# Altium schematic sheet 28pins_Antariksh_unoR3_V1I1_Schematic.SchDoc (part 1 of 5)
size A2
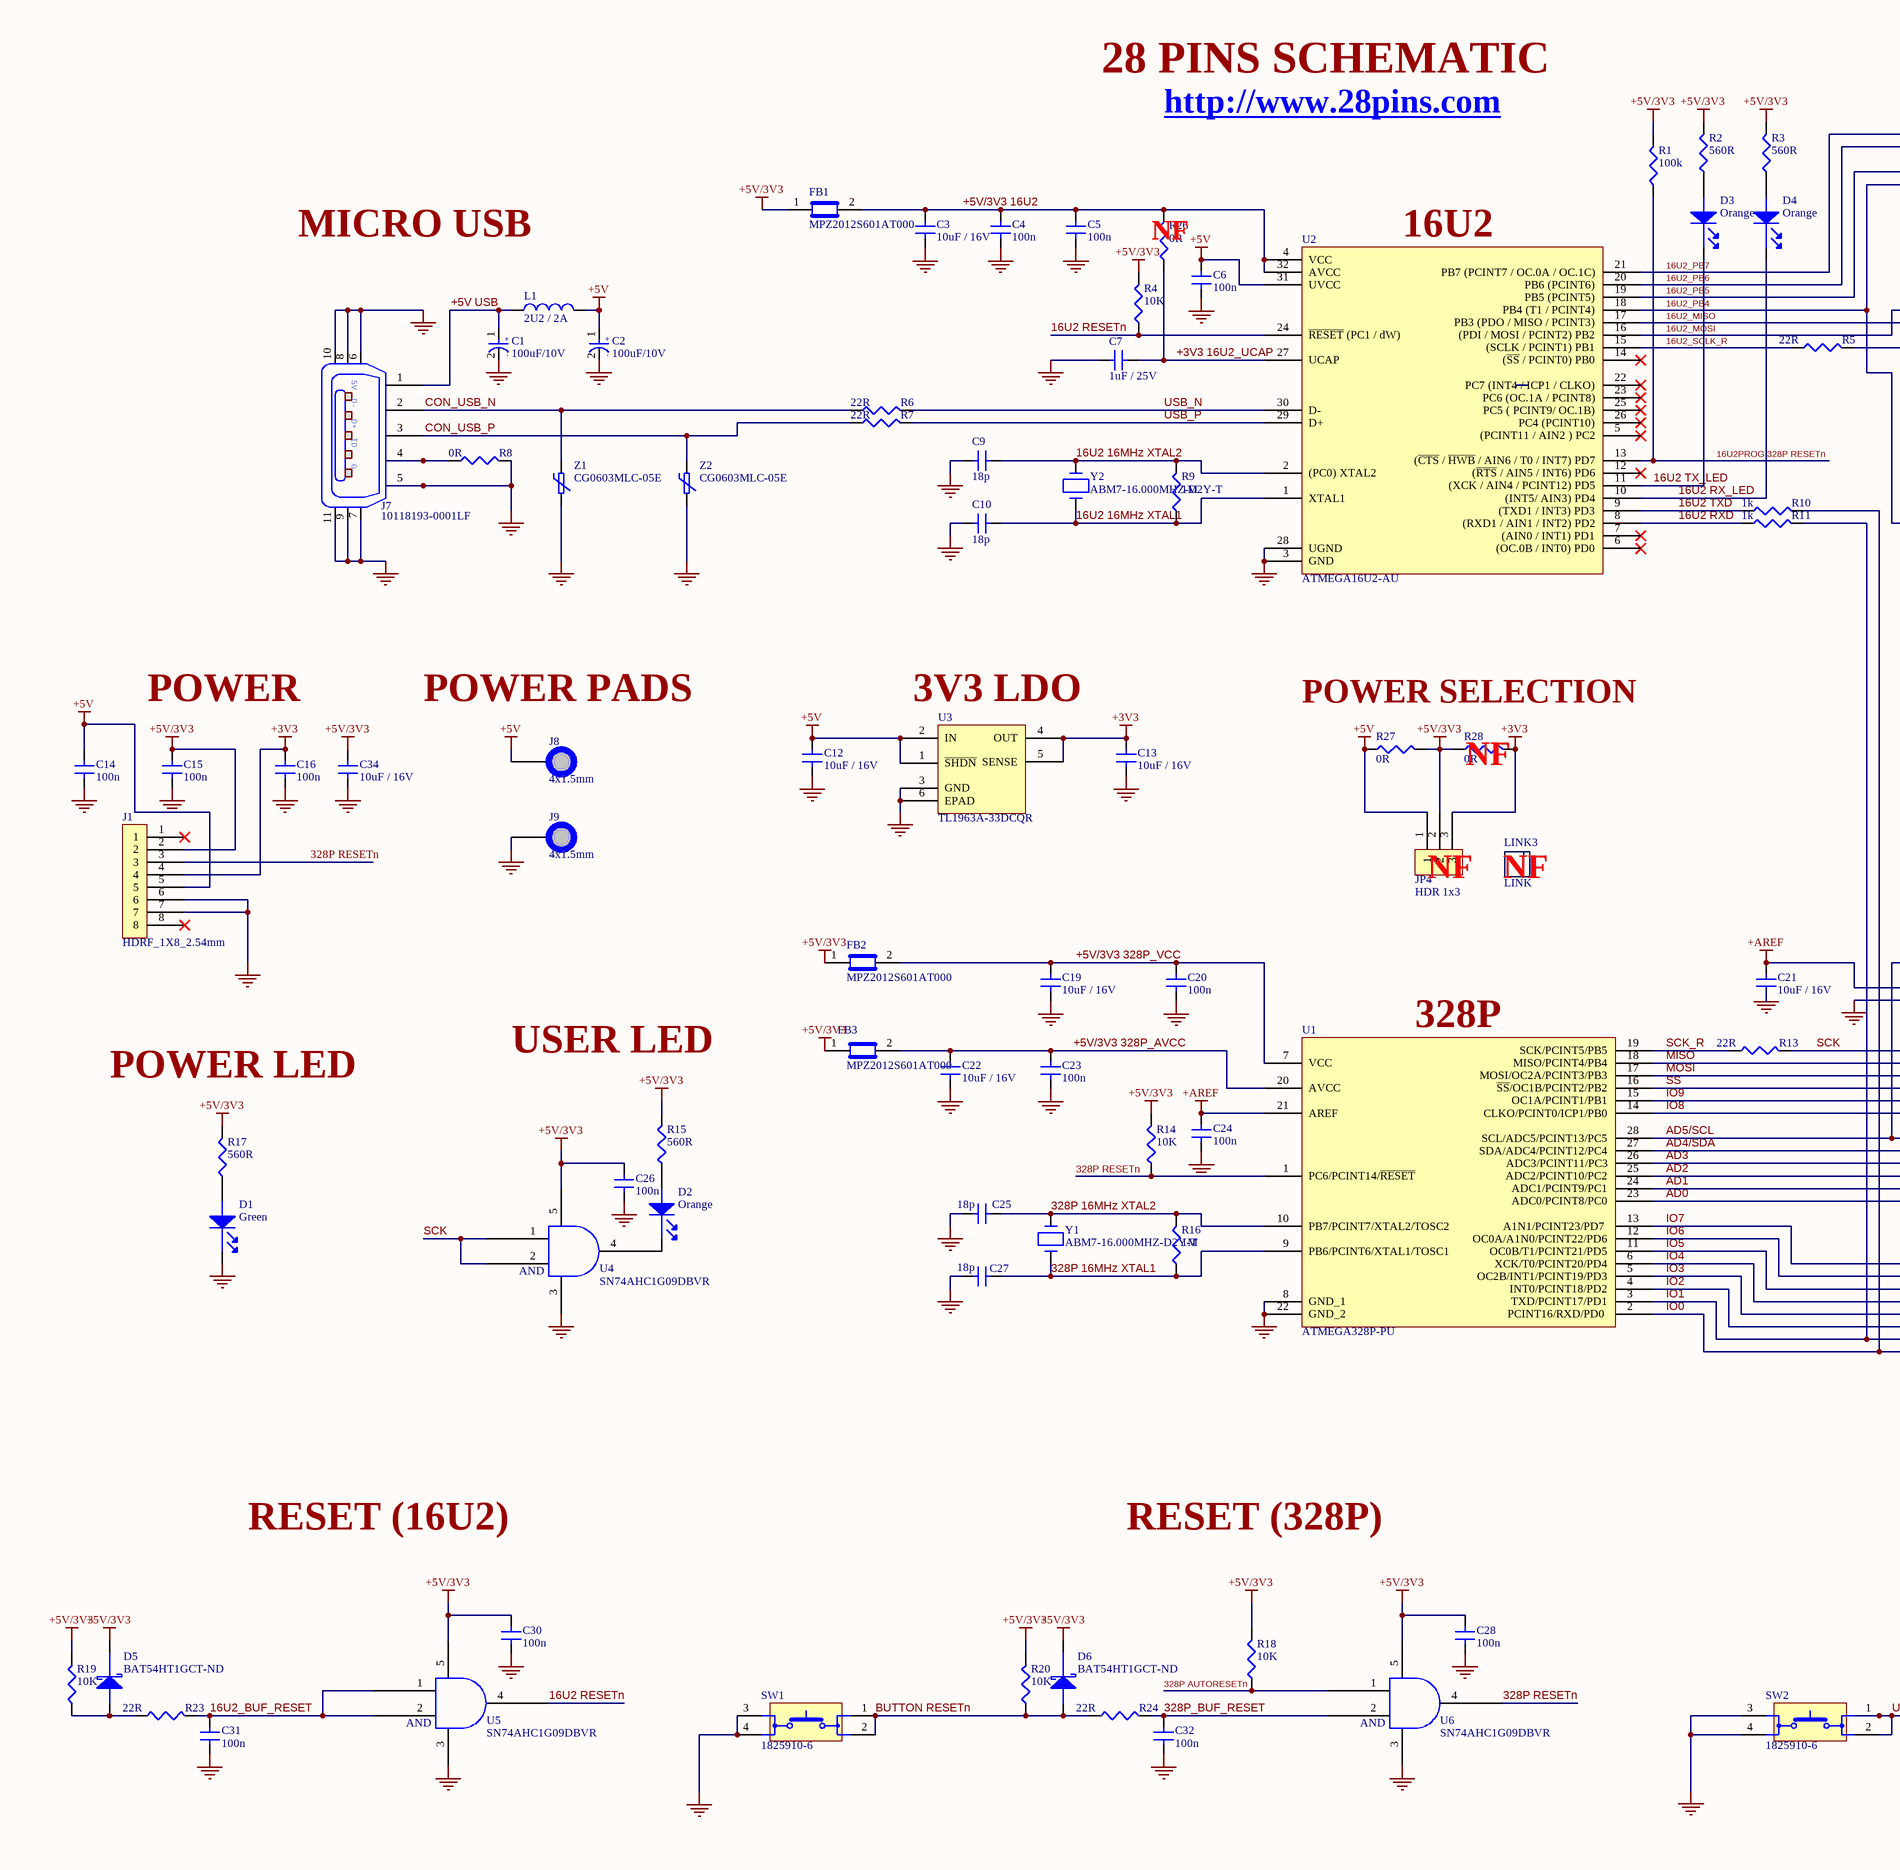
[diagram p0: 28pins_Antariksh_unoR3_V1I1_Schematic.SchDoc, left]
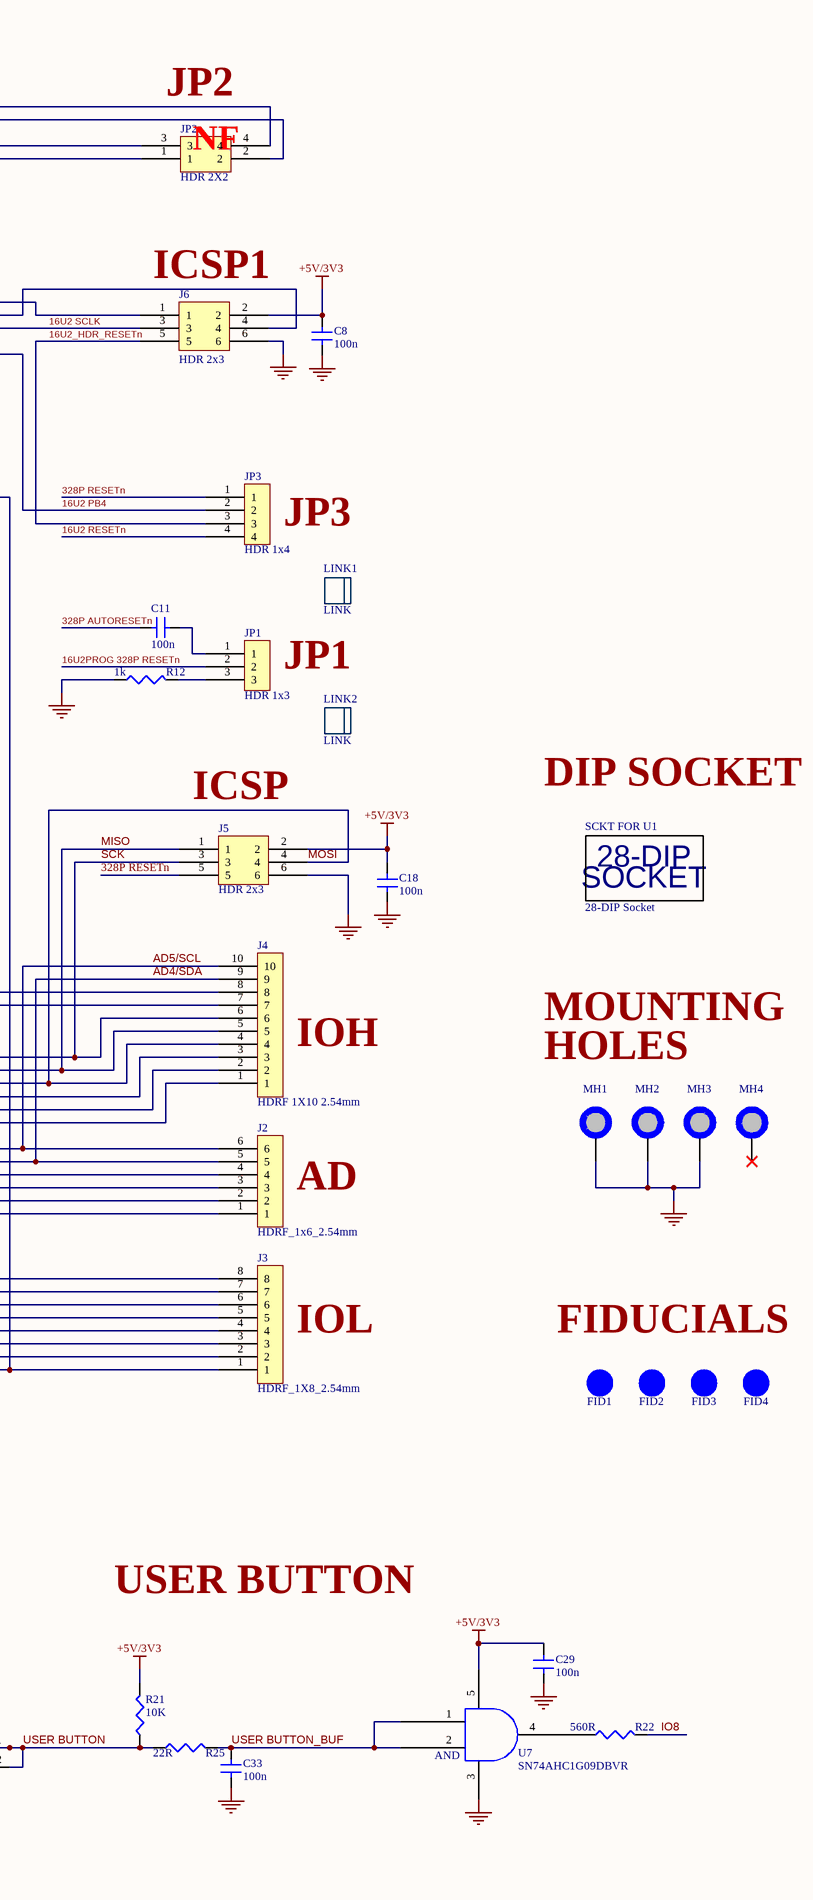
[diagram p1: 28pins_Antariksh_unoR3_V1I1_Schematic.SchDoc, right]

## Parts
C1  100uF/10V  [C_ALU_C_SIZE]
C2  100uF/10V  [C_ALU_C_SIZE]
C3  10uF / 16V  [C0805]
C4  100n  [C0805]
C5  100n  [C0805]
C6  100n  [C0805]
C7  1uF / 25V  [C0805]
C8  100n  [C0805]
C9  18p  [C0805]
C10  18p  [C0805]
C11  100n  [C0805]
C12  10uF / 16V  [C0805]
C13  10uF / 16V  [C0805]
C14  100n  [C0805]
C15  100n  [C0805]
C16  100n  [C0805]
C18  100n  [C0805]
C19  10uF / 16V  [C0805]
C20  100n  [C0805]
C21  10uF / 16V  [C0805]
C22  10uF / 16V  [C0805]
C23  100n  [C0805]
C24  100n  [C0805]
C25  18p  [C0805]
C26  100n  [C0805]
C27  18p  [C0805]
C28  100n  [C0805]
C29  100n  [C0805]
C30  100n  [C0805]
C31  100n  [C0805]
C32  100n  [C0805]
C33  100n  [C0805]
C34  10uF / 16V  [C0805]
D1  Green  [LED_0603]
D2  Orange  [LED_0603]
D3  Orange  [LED_0603]
D4  Orange  [LED_0603]
D5  BAT54HT1GCT-ND  [SOD323]
D6  BAT54HT1GCT-ND  [SOD323]
FB1  MPZ2012S601AT000  [C0805]
FB2  MPZ2012S601AT000  [C0805]
FB3  MPZ2012S601AT000  [C0805]
FID1  FID_1mm  [FID_40x120]  (value not drawn)  (no BOM)
FID2  FID_1mm  [FID_40x120]  (value not drawn)  (no BOM)
FID3  FID_1mm  [FID_40x120]  (value not drawn)  (no BOM)
FID4  FID_1mm  [FID_40x120]  (value not drawn)  (no BOM)
J1  HDRF_1X8_2.54mm  [HDR_F_1X8_2.54mm]
J2  HDRF_1x6_2.54mm  [HDR_F_1X6_2.54mm]
J3  HDRF_1X8_2.54mm  [HDR_F_1X8_2.54mm]
J4  HDRF 1X10 2.54mm  [HDR_F_1X10_2.54mm]
J5  HDR 2x3  [HDR_2x3_2.54mm]
J6  HDR 2x3  [HDR_2x3_2.54mm]
J7  10118193-0001LF  [10118193]
J8  4x1.5mm  [PAD_WITH_HOLE_4x1.5mm]  (no BOM)
J9  4x1.5mm  [PAD_WITH_HOLE_4x1.5mm]  (no BOM)
JP1  HDR 1x3  [HDR_1X3_2.54mm]
JP2  HDR 2X2  [HDR_2x2_2.54mm]
JP3  HDR 1x4  [HDR_1X4_2.54mm]
JP4  HDR 1x3  [HDR_1X3_2.54mm]
L1  2U2 / 2A  [CL210_IND]
LINK1  LINK  (mechanical)
LINK2  LINK  (mechanical)
LINK3  LINK  (mechanical)
MH1  MH_7.4mmCX3.2mmD  [MH_7.4mmCx3.2mmD]  (value not drawn)  (no BOM)
MH2  MH_7.4mmCX3.2mmD  [MH_7.4mmCx3.2mmD]  (value not drawn)  (no BOM)
MH3  MH_7.4mmCX3.2mmD  [MH_7.4mmCx3.2mmD]  (value not drawn)  (no BOM)
MH4  MH_7.4mmNCx2.3mmD  [MH_7.4mmNCx3.2mmD]  (value not drawn)  (no BOM)
R1  100k  [R0805]
R2  560R  [R0805]
R3  560R  [R0805]
R4  10K  [R0805]
R5  22R  [R0805]
R6  22R  [R0805]
R7  22R  [R0805]
R8  0R  [R0805]
R9  1M  [R0805]
R10  1k  [R0805]
R11  1k  [R0805]
R12  1k  [R0805]
R13  22R  [R0805]
R14  10K  [R0805]
R15  560R  [R0805]
R16  1M  [R0805]
R17  560R  [R0805]
R18  10K  [R0805]
R19  10K  [R0805]
R20  10K  [R0805]
R21  10K  [R0805]
R22  560R  [R0805]
R23  22R  [R0805]
R24  22R  [R0805]
R25  22R  [R0805]
R26  0R  [R0805]
R27  0R  [R0805]
R28  0R  [R0805]
SCKT_FOR_U1  28-DIP Socket  [28-DIP_7.62mm_SOCKET]
SW1  1825910-6  [1825910-6]
SW2  1825910-6  [1825910-6]
U1  ATMEGA328P-PU  [28_DIP_7.62mm]
U2  ATMEGA16U2-AU  [TQFP32]
U3  TL1963A-33DCQR  [DCQ (R-PDSO-G6)]
U4  SN74AHC1G09DBVR  [DBV_SOP_23_5]
U5  SN74AHC1G09DBVR  [DBV_SOP_23_5]
U6  SN74AHC1G09DBVR  [DBV_SOP_23_5]
U7  SN74AHC1G09DBVR  [DBV_SOP_23_5]
Y1  ABM7-16.000MHZ-D2Y-T  [ABM7_v1_1_BIG]
Y2  ABM7-16.000MHZ-D2Y-T  [ABM7_v1_1_BIG]
Z1  CG0603MLC-05E  [R0603]
Z2  CG0603MLC-05E  [R0603]

## Nets
+3V3: C13.2 C16.2 J1.4 JP4.3 R28.2 U3.4(OUT) U3.5(SENSE)
+5V: C2.1 C6.2 C12.2 C14.2 J1.5 J8.1 JP4.1 L1.2 R27.1 U2.31(UVCC) U3.1(~{SHDN}) U3.2(IN)
+5V/3V3: C8.2 C15.2 C18.2 C26.2 C28.2 C29.2 C30.2 C34.2 D5.1(C) D6.1(C) FB1.1 FB2.1 FB3.1 J1.2 J5.2 J6.2 JP4.2 R1.2 R2.2 R3.2 R4.2 R14.2 R15.2 R17.2 R18.2 R19.2 R20.2 R21.2 R27.2 R28.1 U4.5 U5.5 U6.5 U7.5
+AREF: C21.2 C24.2 J4.8 U1.21(AREF)
GND: C1.2 C2.2 C3.1 C4.1 C5.1 C6.1 C7.1 C8.1 C9.1 C10.1 C12.1 C13.1 C14.1 C15.1 C16.1 C18.1 C19.1 C20.1 C21.1 C22.1 C23.1 C24.1 C25.1 C26.1 C27.1 C28.1 C29.1 C30.1 C31.1 C32.1 C33.1 C34.1 D1.1(C) J1.6 J1.7 J4.7 J5.6 J6.6 J7.5 J7.6 J7.7 J7.8 J7.9 J7.10 J7.11 J9.1 MH1.1 MH2.1 MH3.1 R8.2 R12.1 SW1.3 SW1.4 SW2.3 SW2.4 U1.8(GND_1) U1.22(GND_2) U2.3(GND) U2.28(UGND) U3.3(GND) U3.6(EPAD) U4.3 U5.3 U6.3 U7.3 Z1.1 Z2.1
16U2 16MHz XTAL1: C10.2 R9.1 U2.1(XTAL1) Y2.1
16U2 16MHz XTAL2: C9.2 R9.2 U2.2((PC0)_XTAL2) Y2.2
16U2 PB4: JP2.1 JP3.2 U2.18(PB4_(T1_/_PCINT4))  [also labelled 16U2_PB4]
16U2 RESETn: JP3.4 R4.1 U2.24(~{RESET}_(PC1_/_dW)) U5.4
16U2 RX_LED: D4.1(C) U2.10((INT5/_AIN3)_PD4)
16U2 RXD: R11.1 U2.8((RXD1_/_AIN1_/_INT2)_PD2)
16U2 SCLK: J6.3 R5.2
16U2 TX_LED: D3.1(C) U2.11((XCK_/_AIN4_/_PCINT12)_PD5)
16U2 TXD: R10.1 U2.9((TXD1_/_INT3)_PD3)
16U2_BUF_RESET: C31.2 R23.2 U5.1 U5.2
16U2_HDR_RESETn: J6.5 JP3.3
16U2_MISO: J6.1 U2.17(PB3_(PDO_/_MISO_/_PCINT3))
16U2_MOSI: J6.4 U2.16((PDI_/_MOSI_/_PCINT2)_PB2)
16U2_PB5: JP2.3 U2.19(PB5_(PCINT5))
16U2_PB6: JP2.2 U2.20(PB6_(PCINT6))
16U2_PB7: JP2.4 U2.21(PB7_(PCINT7_/_OC.0A_/_OC.1C))
16U2_SCLK_R: R5.1 U2.15((SCLK_/_PCINT1)_PB1)
16U2PROG 328P RESETn: JP1.2 R1.1 U2.13((~{CTS}_/_~{HWB}_/_AIN6_/_T0_/_INT7)_PD7)
328P 16MHz XTAL1: C27.2 R16.1 U1.9(PB6/PCINT6/XTAL1/TOSC1) Y1.1
328P 16MHz XTAL2: C25.2 R16.2 U1.10(PB7/PCINT7/XTAL2/TOSC2) Y1.2
328P AUTORESETn: C11.2 R18.1 U6.1
328P RESETn: J1.3 J5.5 JP3.1 R14.1 U1.1(PC6/PCINT14/~{RESET}) U6.4
328P_BUF_RESET: C32.2 R24.2 U6.2
+3V3 16U2_UCAP: C7.2 R26.1 U2.27(UCAP)
+5V USB: C1.1 J7.1 L1.1
+5V/3V3 16U2: C3.2 C4.2 C5.2 FB1.2 R26.2 U2.4(VCC) U2.32(AVCC)
+5V/3V3 328P_AVCC: C22.2 C23.2 FB3.2 U1.20(AVCC)
+5V/3V3 328P_VCC: C19.2 C20.2 FB2.2 U1.7(VCC)
AD0: J2.1 U1.23(ADC0/PCINT8/PC0)
AD1: J2.2 U1.24(ADC1/PCINT9/PC1)
AD2: J2.3 U1.25(ADC2/PCINT10/PC2)
AD3: J2.4 U1.26(ADC3/PCINT11/PC3)
AD4/SDA: J2.5 J4.9 U1.27(SDA/ADC4/PCINT12/PC4)
AD5/SCL: J2.6 J4.10 U1.28(SCL/ADC5/PCINT13/PC5)
BUTTON RESETn: D6.2(A) R20.1 R24.1 SW1.1 SW1.2
CON_USB_N: J7.2 R6.1 Z1.2
CON_USB_P: J7.3 R7.1 Z2.2
IO0: J3.1 R10.2 U1.2(PCINT16/RXD/PD0)
IO1: J3.2 R11.2 U1.3(TXD/PCINT17/PD1)
IO2: J3.3 U1.4(INT0/PCINT18/PD2)
IO3: J3.4 U1.5(OC2B/INT1/PCINT19/PD3)
IO4: J3.5 U1.6(XCK/T0/PCINT20/PD4)
IO5: J3.6 U1.11(OC0B/T1/PCINT21/PD5)
IO6: J3.7 U1.12(OC0A/A1N0/PCINT22/PD6)
IO7: J3.8 U1.13(A1N1/PCINT23/PD7)
IO8: J4.1 R22.2 U1.14(CLKO/PCINT0/ICP1/PB0)
IO9: J4.2 U1.15(OC1A/PCINT1/PB1)
MISO: J4.5 J5.1 U1.18(MISO/PCINT4/PB4)
MOSI: J4.4 J5.4 U1.17(MOSI/OC2A/PCINT3/PB3)
SCK: J4.6 J5.3 R13.2 U4.1 U4.2
SCK_R: R13.1 U1.19(SCK/PCINT5/PB5)
SS: J4.3 U1.16(~{SS}/OC1B/PCINT2/PB2)
USB_N: R6.2 U2.30(D-)
USB_P: R7.2 U2.29(D+)
USER BUTTON: R21.1 R25.1 SW2.1 SW2.2
USER BUTTON_BUF: C33.2 R25.2 U7.1 U7.2
NetC11_1: C11.1 JP1.1
NetD1_2: D1.2(A) R17.1
NetD2_1: D2.1(C) U4.4
NetD2_2: D2.2(A) R15.1
NetD3_2: D3.2(A) R2.1
NetD4_2: D4.2(A) R3.1
NetD5_2: D5.2(A) R19.1 R23.1
NetJ7_4: J7.4 R8.1
NetJP1_3: JP1.3 R12.2
NetR22_1: R22.1 U7.4

Not connected (* = marked no-connect by the designer): J1 1* 8*; MH4 1*; U2 5((PCINT11_/_AIN2_)_PC2)* 6((OC.0B_/_INT0)_PD0)* 7((AIN0_/_INT1)_PD1)* 12((~{RTS}_/_AIN5_/_INT6)_PD6)* 14((~{SS}_/_PCINT0)_PB0)* 22(PC7_(INT4_/_ICP1_/_CLKO))* 23(PC6_(OC.1A_/_PCINT8))* 25(PC5_(_PCINT9/_OC.1B))* 26(PC4_(PCINT10))*

## Notes on the sheet
- 28 PINS SCHEMATIC
- http://www.28pins.com <https://www.28pins.com/>
- (near JP2) JP2
- (near JP2) NF
- MICRO USB
- (near R26) NF
- (near U2) 16U2
- (near J6) ICSP1
- JP3
- POWER
- POWER PADS
- (near U3) 3V3 LDO
- POWER SELECTION
- JP1
- (near R28) NF
- DIP SOCKET
- (near J5) ICSP
- (near JP4) NF
- (near LINK3) NF
- (near U1) 328P
- (near J4) IOH
- MOUNTING
- POWER LED
- USER LED
- HOLES
- (near J2) AD
- (near J3) IOL
- FIDUCIALS
- RESET (16U2)
- RESET (328P)
- USER BUTTON
- (in symbol 4828-3004-CP) 28-DIP; SOCKET
- (in symbol 10118193-0001LF) 5V; D-; D+; ID; G
- (in symbol EEE-1AA101WR) +; -